# EAGLE design R122X (EAGLE 6.6.0)
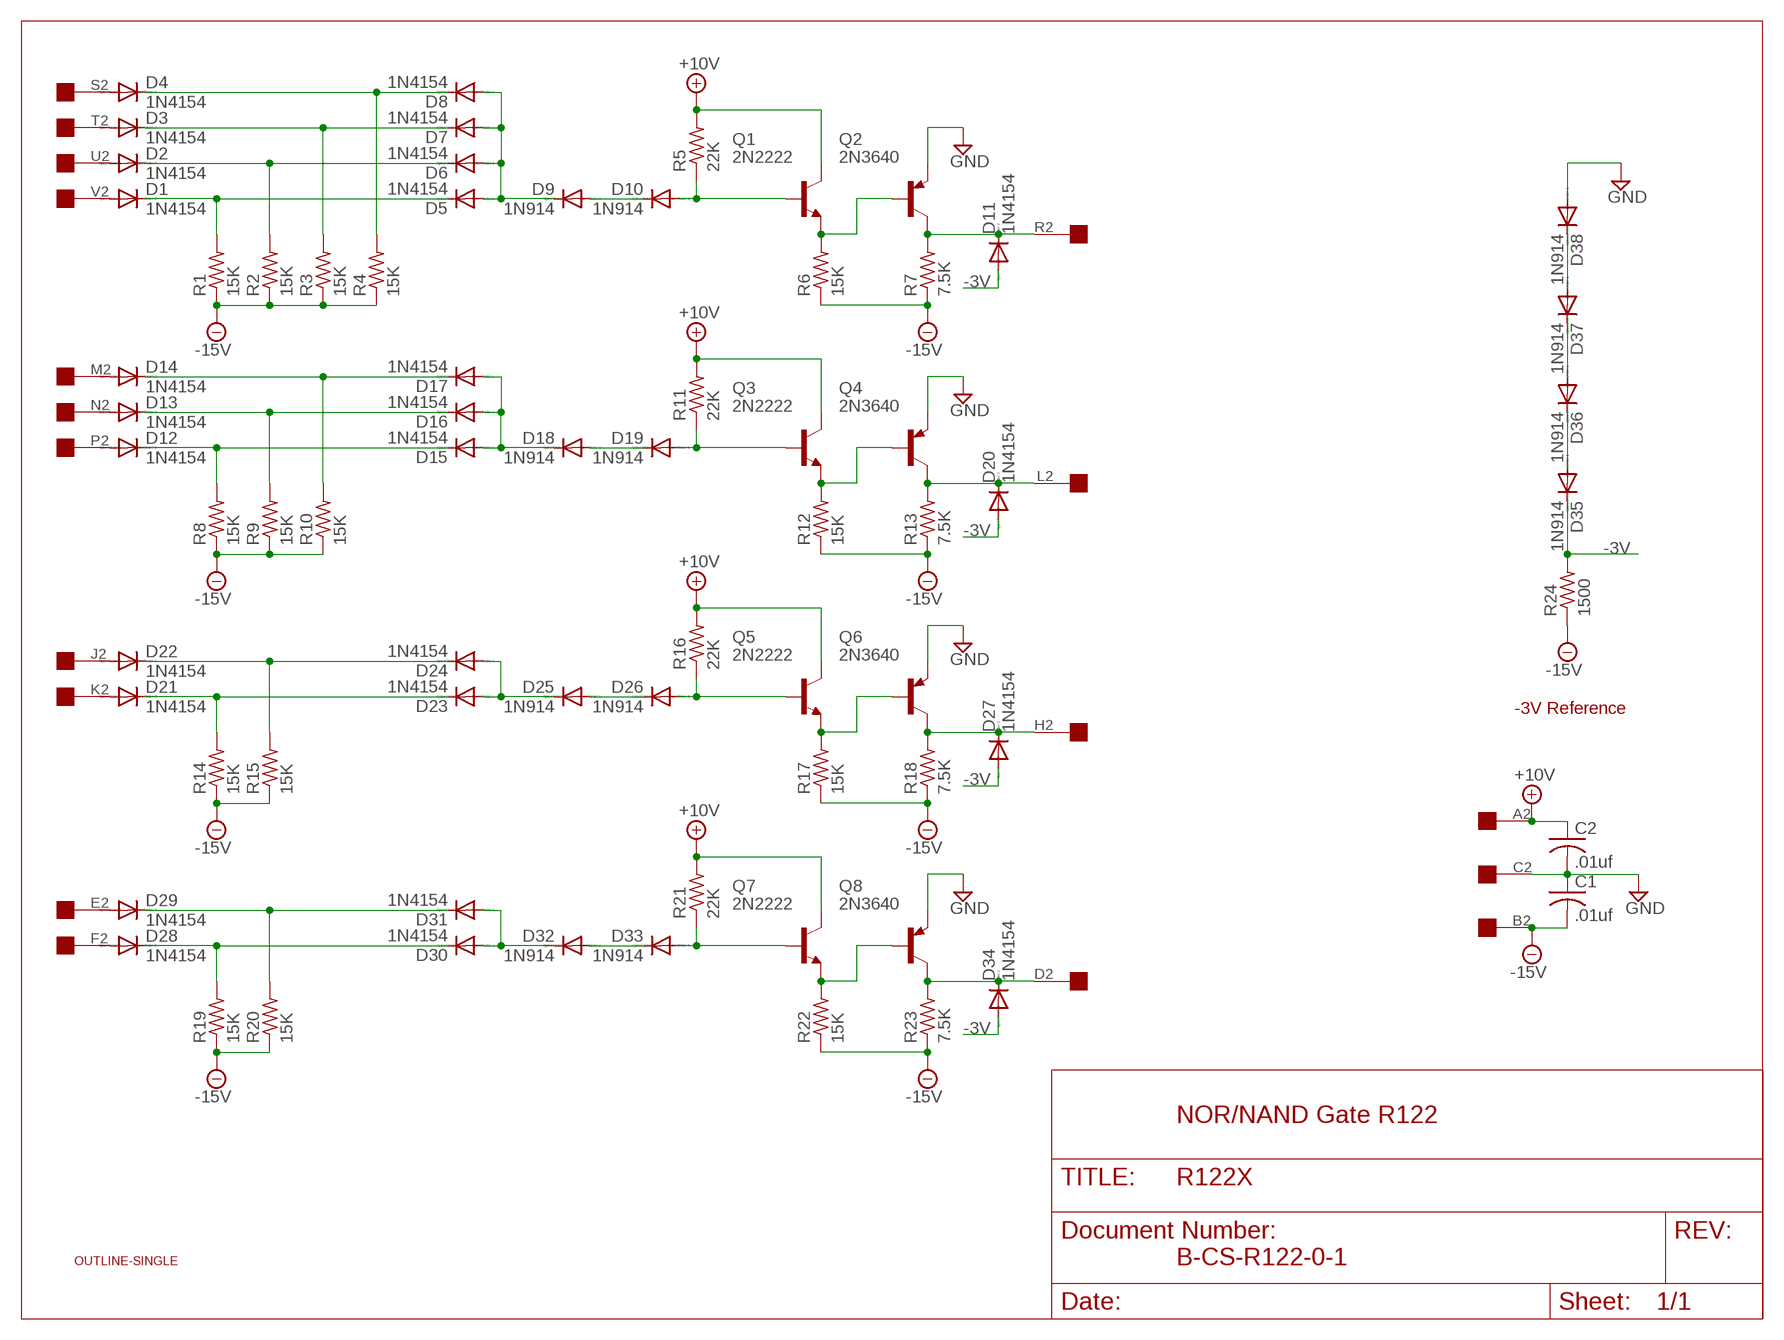
[diagram p0: schematic, sheet 1]

## Parts
C1  .01uf  C-US050-025X075  [C050-025X075]
C2  .01uf  C-US050-025X075  [C050-025X075]
D1  1N4154  1N4148DO35-10  [DO35-10]
D2  1N4154  1N4148DO35-10  [DO35-10]
D3  1N4154  1N4148DO35-10  [DO35-10]
D4  1N4154  1N4148DO35-10  [DO35-10]
D5  1N4154  1N4148DO35-10  [DO35-10]
D6  1N4154  1N4148DO35-10  [DO35-10]
D7  1N4154  1N4148DO35-10  [DO35-10]
D8  1N4154  1N4148DO35-10  [DO35-10]
D9  1N914  1N4148DO35-10  [DO35-10]
D10  1N914  1N4148DO35-10  [DO35-10]
D11  1N4154  1N4148DO35-10  [DO35-10]
D12  1N4154  1N4148DO35-10  [DO35-10]
D13  1N4154  1N4148DO35-10  [DO35-10]
D14  1N4154  1N4148DO35-10  [DO35-10]
D15  1N4154  1N4148DO35-10  [DO35-10]
D16  1N4154  1N4148DO35-10  [DO35-10]
D17  1N4154  1N4148DO35-10  [DO35-10]
D18  1N914  1N4148DO35-10  [DO35-10]
D19  1N914  1N4148DO35-10  [DO35-10]
D20  1N4154  1N4148DO35-10  [DO35-10]
D21  1N4154  1N4148DO35-10  [DO35-10]
D22  1N4154  1N4148DO35-10  [DO35-10]
D23  1N4154  1N4148DO35-10  [DO35-10]
D24  1N4154  1N4148DO35-10  [DO35-10]
D25  1N914  1N4148DO35-10  [DO35-10]
D26  1N914  1N4148DO35-10  [DO35-10]
D27  1N4154  1N4148DO35-10  [DO35-10]
D28  1N4154  1N4148DO35-10  [DO35-10]
D29  1N4154  1N4148DO35-10  [DO35-10]
D30  1N4154  1N4148DO35-10  [DO35-10]
D31  1N4154  1N4148DO35-10  [DO35-10]
D32  1N914  1N4148DO35-10  [DO35-10]
D33  1N914  1N4148DO35-10  [DO35-10]
D34  1N4154  1N4148DO35-10  [DO35-10]
D35  1N914  1N4148DO35-10  [DO35-10]
D36  1N914  1N4148DO35-10  [DO35-10]
D37  1N914  1N4148DO35-10  [DO35-10]
D38  1N914  1N4148DO35-10  [DO35-10]
Q1  2N2222  2N1711-NPN-TO39-EBC  [TO39]
Q2  2N3640  2N3637  [TO39]
Q3  2N2222  2N1711-NPN-TO39-EBC  [TO39]
Q4  2N3640  2N3637  [TO39]
Q5  2N2222  2N1711-NPN-TO39-EBC  [TO39]
Q6  2N3640  2N3637  [TO39]
Q7  2N2222  2N1711-NPN-TO39-EBC  [TO39]
Q8  2N3640  2N3637  [TO39]
R1  15K  R-US_0207/10  [0207/10]
R2  15K  R-US_0207/10  [0207/10]
R3  15K  R-US_0207/10  [0207/10]
R4  15K  R-US_0207/10  [0207/10]
R5  22K  R-US_0207/10  [0207/10]
R6  15K  R-US_0207/10  [0207/10]
R7  7.5K  R-US_0207/10  [0207/10]
R8  15K  R-US_0207/10  [0207/10]
R9  15K  R-US_0207/10  [0207/10]
R10  15K  R-US_0207/10  [0207/10]
R11  22K  R-US_0207/10  [0207/10]
R12  15K  R-US_0207/10  [0207/10]
R13  7.5K  R-US_0207/10  [0207/10]
R14  15K  R-US_0207/10  [0207/10]
R15  15K  R-US_0207/10  [0207/10]
R16  22K  R-US_0207/10  [0207/10]
R17  15K  R-US_0207/10  [0207/10]
R18  7.5K  R-US_0207/10  [0207/10]
R19  15K  R-US_0207/10  [0207/10]
R20  15K  R-US_0207/10  [0207/10]
R21  22K  R-US_0207/10  [0207/10]
R22  15K  R-US_0207/10  [0207/10]
R23  7.5K  R-US_0207/10  [0207/10]
R24  1500  R-US_0207/10  [0207/10]
U$1  OUTLINE-SINGLE  [SINGLE]
U$2  EDGE-1  [EDGE-CON1]

## Nets
+10V [Power]: C2.1 Q1.3(C) Q3.3(C) Q5.3(C) Q7.3(C) R5.2 R11.2 R16.2 R21.2 U$2.A2
-3V [Power]: D11.A D20.A D27.A D34.A D35.C R24.2
-15V [Power]: C1.2 R1.1 R2.1 R3.1 R4.1 R6.1 R7.1 R8.1 R9.1 R10.1 R12.1 R13.1 R14.1 R15.1 R17.1 R18.1 R19.1 R20.1 R22.1 R23.1 R24.1 U$2.B2
GND [Power]: C1.1 C2.2 D38.A Q2.1(E) Q4.1(E) Q6.1(E) Q8.1(E) U$2.C2
N$1: D19.A Q3.2(B) R11.1
N$2: D14.A U$2.M2
N$3: D37.A D38.C
N$4: D12.C D15.C R8.2
N$5: D11.C Q2.3(C) R7.2 U$2.R2
N$6: D18.A D19.C
N$7: D13.A U$2.N2
N$8: D20.C Q4.3(C) R13.2 U$2.L2
N$9: D12.A U$2.P2
N$10: D21.A U$2.K2
N$11: D15.A D16.A D17.A D18.C
N$12: D22.A U$2.J2
N$13: D36.A D37.C
N$14: D14.C D17.C R10.2
N$15: D13.C D16.C R9.2
N$16: D35.A D36.C
N$17: Q3.1(E) Q4.2(B) R12.2
N$18: D26.A Q5.2(B) R16.1
N$19: D10.A Q1.2(B) R5.1
N$20: D4.A U$2.S2
N$21: D1.A U$2.V2
N$22: D1.C D5.C R1.2
N$23: D9.A D10.C
N$24: D28.A U$2.F2
N$25: D3.A U$2.T2
N$26: D21.C D23.C R14.2
N$27: D25.A D26.C
N$28: D29.A U$2.E2
N$29: D5.A D6.A D7.A D8.A D9.C
N$30: D4.C D8.C R4.2
N$31: D27.C Q6.3(C) R18.2 U$2.H2
N$32: D3.C D7.C R3.2
N$33: D2.C D6.C R2.2
N$34: Q1.1(E) Q2.2(B) R6.2
N$37: D23.A D24.A D25.C
N$39: D2.A U$2.U2
N$41: D22.C D24.C R15.2
N$42: Q5.1(E) Q6.2(B) R17.2
N$43: D33.A Q7.2(B) R21.1
N$45: D28.C D30.C R19.2
N$46: D32.A D33.C
N$48: D34.C Q8.3(C) R23.2 U$2.D2
N$51: D30.A D31.A D32.C
N$54: D29.C D31.C R20.2
N$55: Q7.1(E) Q8.2(B) R22.2

## Notes on the sheet
- -3V Reference
- NOR/NAND Gate R122
- B-CS-R122-0-1

## Library data of the parts
C1 C2 = rcl:C-US: CAPACITOR, American symbol
D1-D38 = diode:1N4148: DIODE high speed (Philips)
Q1 Q3 Q5 Q7 = transistor:*-NPN-: NPN Transistror BF959 corrected 2008.03.06
Q2 Q4 Q6 Q8 = transistor-pnp:2N3637*: PNP Transistror
R1-R24 = rcl:R-US_: RESISTOR, American symbol
U$1 = dec-con:OUTLINE-*: Board outlines for DEC boards.
U$2 = dec-con:EDGE-1: Single-Sided DEC Edge Connector -- (side 2)

## Net classes
1 Power: width 0.813 mm

## Board
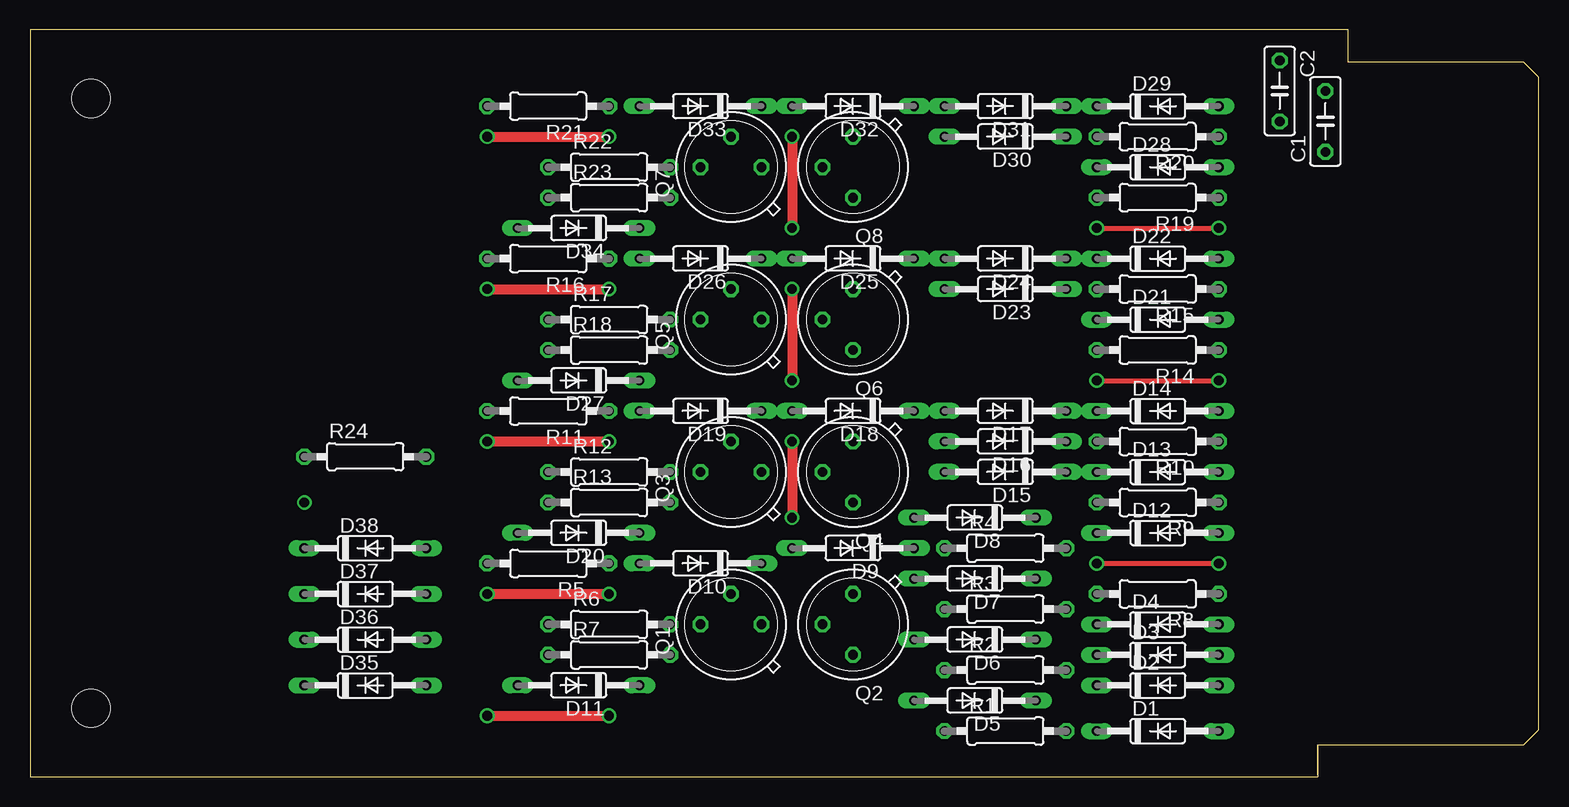
[diagram p1: board, top side]
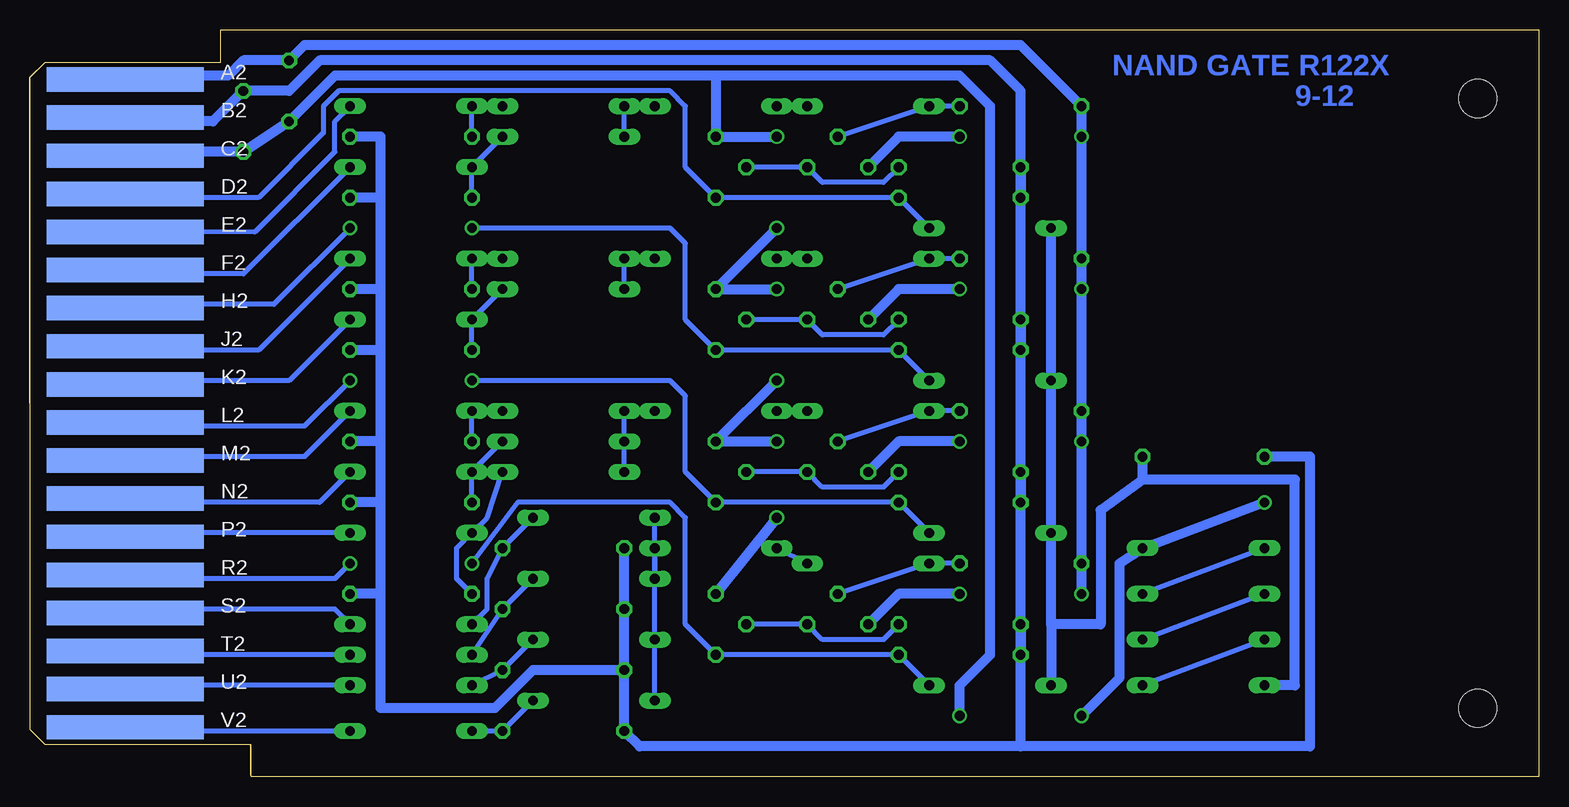
[diagram p2: board, bottom side, seen from below]

Size 125.73 x 62.23 mm. Coordinates in mm from the lower left corner, seen from the top.
Copper layers (1+16): Top 0.035mm / dielectric 1.5mm / Bottom 0.035mm
Design rules "16mils": minimum track width 16mil, minimum drill 32mil, track to track 15mil, track to pad 10mil, pad to pad 10mil, via to via 10mil, smd to smd 10mil, copper to edge 13mil, drill to drill 10mil, minimum pad ring 10mil, minimum via ring 8mil, stop-mask expansion 0mil, vias tented up to drill 0mil, thermal gap 10mil

### Footprints (pad centres in the part's own frame; a part is rotated, then mirrored left to right if it is on the bottom)
C050-025X075 = drill 0.813 octagon: 1 -2.54,0; 2 2.54,0
DO35-10 = drill 0.813 long: A 5.08,0; C -5.08,0
TO39 = drill 0.813 octagon: 1 0,-2.54; 2 2.54,0; 3 0,2.54
0207/10 = drill 0.813 octagon: 1 -5.08,0; 2 5.08,0
SINGLE = hole 3.175: 120.65,56.515; 120.65,5.715
EDGE-CON1 = smd 13.106 x 2.032 bottom: A2 7.938,4.128; B2 7.938,7.303; C2 7.938,10.477; D2 7.938,13.652; E2 7.938,16.828; F2 7.938,20.003; H2 7.938,23.177; J2 7.938,26.352; K2 7.938,29.527; L2 7.938,32.703; M2 7.938,35.877; N2 7.938,39.053; P2 7.938,42.227; R2 7.938,45.403; S2 7.938,48.578; T2 7.938,51.752; U2 7.938,54.928; V2 7.938,58.102

### Placement (x,y rotation side)
C1  107.95,54.61 90 top
C2  104.14,57.15 270 top
D1  93.98,3.81 0 top
D2  93.98,7.62 0 top
D3  93.98,10.16 0 top
D4  93.98,12.7 0 top
D5  78.74,6.35 180 top
D6  78.74,11.43 180 top
D7  78.74,16.51 180 top
D8  78.74,21.59 180 top
D9  68.58,19.05 180 top
D10  55.88,17.78 180 top
D11  45.72,7.62 180 top
D12  93.98,20.32 0 top
D13  93.98,25.4 0 top
D14  93.98,30.48 0 top
D15  81.28,25.4 180 top
D16  81.28,27.94 180 top
D17  81.28,30.48 180 top
D18  68.58,30.48 180 top
D19  55.88,30.48 180 top
D20  45.72,20.32 180 top
D21  93.98,38.1 0 top
D22  93.98,43.18 0 top
D23  81.28,40.64 180 top
D24  81.28,43.18 180 top
D25  68.58,43.18 180 top
D26  55.88,43.18 180 top
D27  45.72,33.02 180 top
D28  93.98,50.8 0 top
D29  93.98,55.88 0 top
D30  81.28,53.34 180 top
D31  81.28,55.88 180 top
D32  68.58,55.88 180 top
D33  55.88,55.88 180 top
D34  45.72,45.72 180 top
D35  27.94,7.62 0 top
D36  27.94,11.43 0 top
D37  27.94,15.24 0 top
D38  27.94,19.05 0 top
Q1  58.42,12.7 90 top
Q2  68.58,12.7 180 top
Q3  58.42,25.4 90 top
Q4  68.58,25.4 180 top
Q5  58.42,38.1 90 top
Q6  68.58,38.1 180 top
Q7  58.42,50.8 90 top
Q8  68.58,50.8 180 top
R1  81.28,3.81 0 top
R2  81.28,8.89 0 top
R3  81.28,13.97 0 top
R4  81.28,19.05 0 top
R5  43.18,17.78 180 top
R6  48.26,12.7 0 top
R7  48.26,10.16 0 top
R8  93.98,15.24 180 top
R9  93.98,22.86 180 top
R10  93.98,27.94 180 top
R11  43.18,30.48 180 top
R12  48.26,25.4 0 top
R13  48.26,22.86 0 top
R14  93.98,35.56 180 top
R15  93.98,40.64 180 top
R16  43.18,43.18 180 top
R17  48.26,38.1 0 top
R18  48.26,35.56 0 top
R19  93.98,48.26 180 top
R20  93.98,53.34 180 top
R21  43.18,55.88 180 top
R22  48.26,50.8 0 top
R23  48.26,48.26 0 top
R24  27.94,26.67 0 top
U$1  125.73,62.23 180 top
U$2  125.73,62.23 180 top

### Tracks (layer width: path | path; a pad name or v marks a point on that pad's centre or on a via)
+10V  (via drill 0.81)
  Top 0.813: v38.1,53.34 v48.26,53.34 | v38.1,40.64 v48.26,40.64 | v38.1,27.94 v48.26,27.94 | v38.1,15.24 v48.26,15.24
  Bottom 0.813: U$2.A2 117.22,58.04 116.84,58.42 109.22,58.42 107.95,59.69 C2.1 102.87,60.96 43.18,60.96 R21.2 v38.1,53.34 R16.2 v38.1,40.64 R11.2 v38.1,27.94 R5.2 v38.1,15.24 | Q7.3 53.34,53.34 v48.26,53.34 | Q5.3 53.34,40.64 v48.26,40.64 | Q3.3 53.34,27.94 v48.26,27.94 | Q1.3 53.34,15.24 v48.26,15.24
-3V
  Bottom 0.813: D27.A D20.A 40.64,12.7 | D27.A D34.A D27.A | D35.C 20.32,7.62 20.32,24.77 33.02,24.77 | 33.02,24.77 R24.2 | 40.64,12.7 D11.A | 40.64,12.7 36.51,12.7 36.51,22.23 33.02,24.77
-15V
  Bottom 0.813: 96.52,15.24 R8.1 | 96.52,15.24 96.52,22.86 | 96.52,22.86 96.52,27.94 | 96.52,27.94 96.52,35.56 | 96.52,35.56 96.52,40.64 | 96.52,40.64 96.52,48.26 | 96.52,48.26 96.52,53.34 R20.1 | 96.52,22.86 R9.1 | 96.52,27.94 R10.1 | 96.52,35.56 R14.1 | 96.52,40.64 R15.1 | 96.52,48.26 R19.1 | U$2.B2 118.06,54.66 118.11,54.61 110.49,54.61 C1.2 104.14,57.15 101.6,59.69 45.72,59.69 43.18,57.15 R23.1 R22.1 R18.1 R17.1 R13.1 R12.1 R7.1 R6.1 43.18,2.54 | R3.1 R4.1 R3.1 | R1.1 R2.1 | R2.1 R3.1 | R1.1 R2.1 | 96.52,15.24 96.52,5.71 87,5.71 83.82,8.89 R2.1 | R1.1 R2.1 | R2.1 R3.1 | R1.1 R2.1 | R1.1 R2.1 | 43.18,2.54 74.93,2.54 R1.1 | R1.1 R2.1 | R24.1 19.05,26.67 19.05,2.54 43.18,2.54
GND  (via drill 0.81)
  Top 0.813: v63.5,27.94 v63.5,21.59 | v63.5,53.34 v63.5,45.72 | v63.5,40.64 v63.5,33.02 | v38.1,5.08 v48.26,5.08
  Bottom 0.813: U$2.C2 117.17,51.74 116.84,52.07 C1.1 C2.2 100.33,58.42 68.58,58.42 | 68.58,58.42 Q8.1 v63.5,53.34 | 68.58,58.42 48.26,58.42 45.72,55.88 45.72,10.16 48.26,7.62 v48.26,5.08 | v63.5,27.94 Q4.1 v63.5,33.02 | v63.5,21.59 Q2.1 | v63.5,45.72 Q6.1 v63.5,40.64 | v38.1,5.08 34.92,8.26 34.92,17.78 D38.A v22.86,22.86
N$1
  Bottom 0.406: R11.1 D19.A Q3.2
N$2
  Bottom 0.406: U$2.M2 117.17,26.34 116.84,26.67 102.87,26.67 D14.A
N$3
  Bottom 0.406: D38.C D37.A
N$4
  Bottom 0.406: D15.C 87.63,21.59 D12.C 90.17,19.05 90.17,16.51 R8.2
N$5  (via drill 0.81)
  Top 0.406: v88.9,17.78 v99.06,17.78
  Bottom 0.406: v88.9,17.78 85.09,22.86 72.39,22.86 71.12,21.59 71.12,12.7 Q2.3 R7.2 D11.C | U$2.R2 116.84,16.51 100.33,16.51 v99.06,17.78
N$6
  Bottom 0.406: D19.C D18.A
N$7
  Bottom 0.406: U$2.N2 117.17,23.19 116.84,22.86 101.6,22.86 D13.A
N$8  (via drill 0.81)
  Top 0.406: v88.9,33.02 v99.06,33.02
  Bottom 0.406: U$2.L2 115.57,29.21 102.87,29.21 v99.06,33.02 | v88.9,33.02 72.39,33.02 71.12,31.75 71.12,25.4 Q4.3 R13.2 D20.C
N$9
  Bottom 0.406: U$2.P2 117.17,19.99 116.84,20.32 D12.A
N$10
  Bottom 0.406: U$2.K2 117.14,32.72 116.84,33.02 104.14,33.02 D21.A
N$11
  Bottom 0.406: D15.A D16.A D17.A D18.C
N$12
  Bottom 0.406: U$2.J2 117.17,35.89 116.84,35.56 106.68,35.56 D22.A
N$13
  Bottom 0.406: D37.C D36.A
N$14
  Bottom 0.406: D14.C D17.C | R10.2 D14.C | R10.2 D14.C | R10.2 D14.C
N$15
  Bottom 0.406: D16.C D13.C R9.2
N$16
  Bottom 0.406: D36.C D35.A
N$17
  Bottom 0.406: R12.2 54.61,24.13 59.69,24.13 Q3.1 Q4.2
N$18
  Bottom 0.406: R16.1 D26.A Q5.2
N$19
  Bottom 0.406: R5.1 D10.A Q1.2
N$20
  Bottom 0.406: U$2.S2 117.14,13.66 116.84,13.97 100.33,13.97 D4.A
N$21
  Bottom 0.406: U$2.V2 116.84,3.81 D1.A
N$22
  Bottom 0.406: R1.2 D5.C R1.2 | R1.2 D1.C
N$23
  Bottom 0.406: D10.C D9.A
N$24
  Bottom 0.406: U$2.F2 115.85,42.19 115.57,41.91 107.95,41.91 D28.A
N$25
  Bottom 0.406: U$2.T2 117.17,10.49 116.84,10.16 D3.A
N$26
  Bottom 0.406: D23.C D21.C R14.2
N$27
  Bottom 0.406: D26.C D25.A
N$28
  Bottom 0.406: U$2.E2 107.01,45.39 100.33,52.07 100.33,54.61 D29.A
N$29
  Bottom 0.406: D5.A D6.A | D6.A D9.C D7.A | D6.A D7.A | D7.A D8.A
N$30
  Bottom 0.406: R4.2 D8.C | R4.2 87.63,16.51 87.63,13.97 D4.C | R4.2 D8.C | R4.2 D8.C
N$31  (via drill 0.81)
  Top 0.406: v88.9,45.72 v99.06,45.72
  Bottom 0.406: U$2.H2 116.84,39.37 105.41,39.37 v99.06,45.72 | v88.9,45.72 72.39,45.72 71.12,44.45 71.12,38.1 Q6.3 R18.2 D27.C
N$32
  Bottom 0.406: R3.2 D3.C | R3.2 D7.C R3.2
N$33
  Bottom 0.406: D2.C R2.2 D6.C
N$34
  Bottom 0.406: R6.2 54.61,11.43 59.69,11.43 Q1.1 Q2.2
N$37
  Bottom 0.406: D23.A D24.A D25.C
N$39
  Bottom 0.406: U$2.U2 117.2,7.26 116.84,7.62 D2.A
N$41
  Bottom 0.406: D24.C D22.C R15.2
N$42
  Bottom 0.406: R17.2 54.61,36.83 59.69,36.83 Q5.1 Q6.2
N$43
  Bottom 0.406: R21.1 D33.A Q7.2
N$45
  Bottom 0.406: D30.C D28.C R19.2
N$46
  Bottom 0.406: D33.C D32.A
N$48
  Bottom 0.406: U$2.D2 117.14,48.56 116.84,48.26 106.68,48.26 101.28,53.66 101.28,55.88 100.01,57.15 72.39,57.15 71.12,55.88 71.12,50.8 Q8.3 R23.2 D34.C
N$51
  Bottom 0.406: D30.A D31.A D32.C
N$54
  Bottom 0.406: D31.C D29.C R20.2
N$55
  Bottom 0.406: Q8.2 Q7.1 59.69,49.53 54.61,49.53 R22.2

### Text on the board
Bottom: NAND GATE R122X | 9-12